# EasyEDA schematic 1-Schematic_ACS2STM-alt-IDC.json
TITLE: ACSI2STM Modified IDC; REV: 1; Date: 2023-06-16; Sheet: 1/1; Drawn By: jfcretro
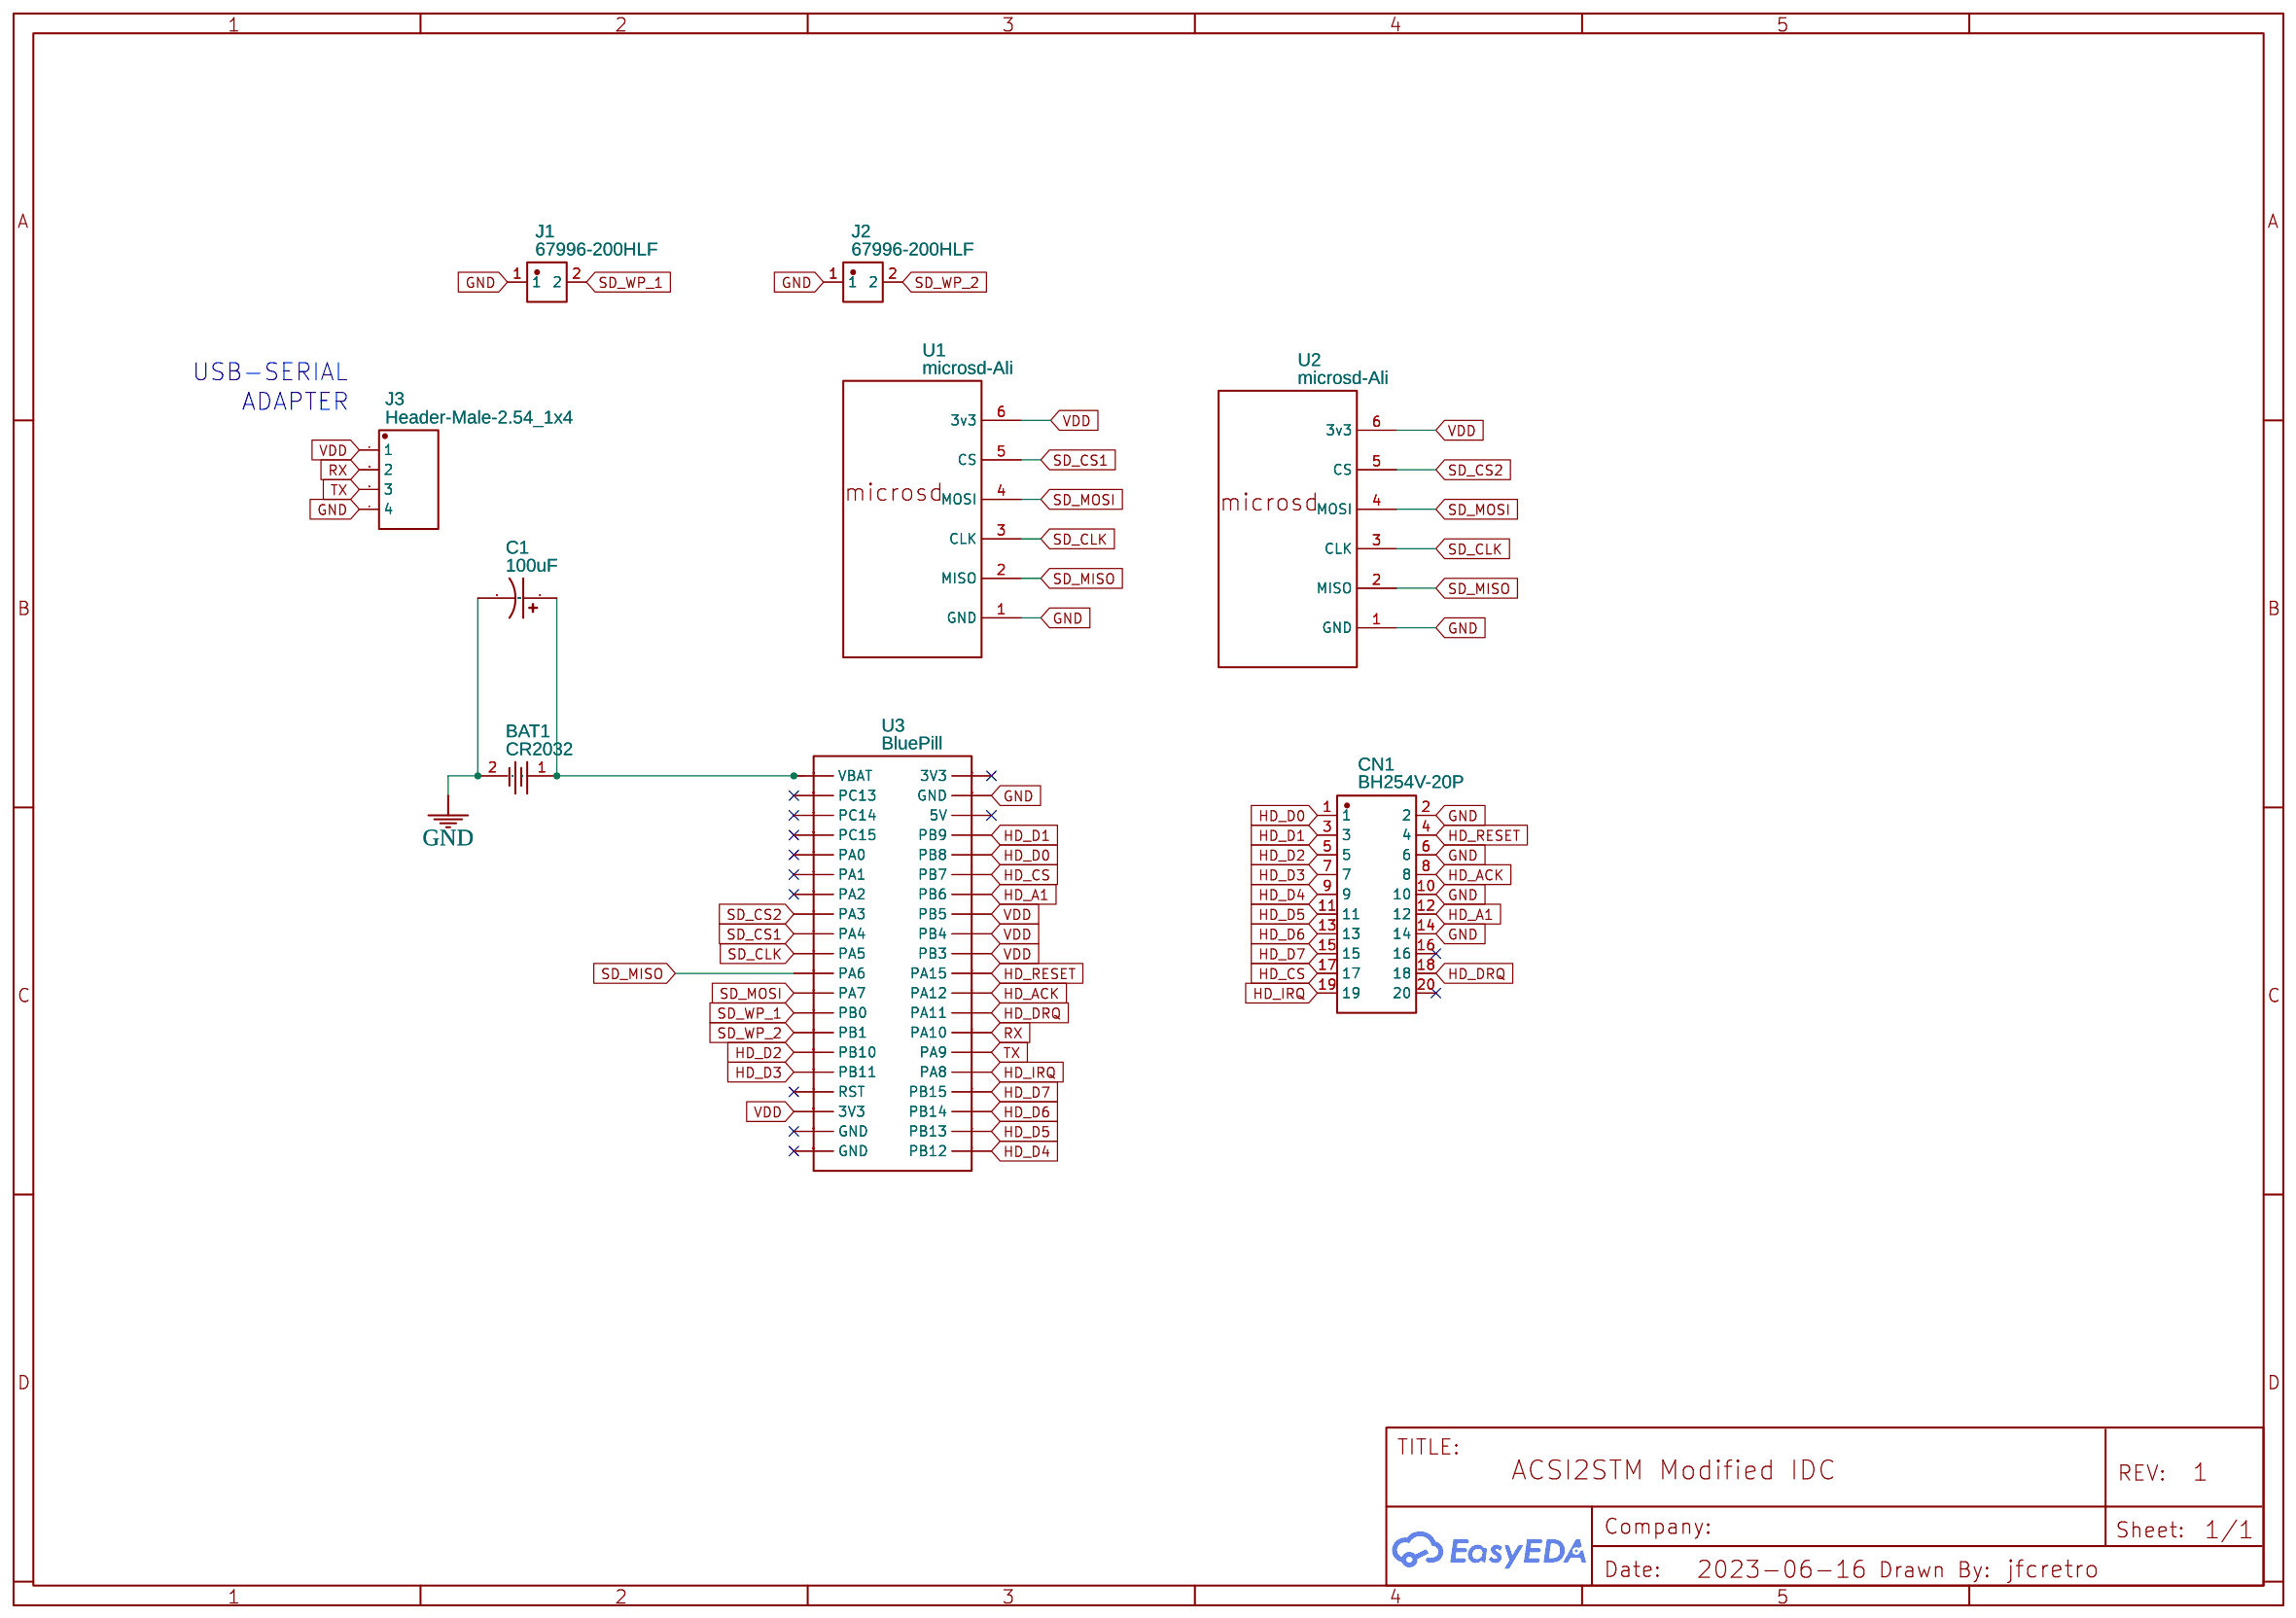
[diagram p0: schematic sheet]

## Parts
BAT1  CR2032  [BAT-TH_CR2032-1]
C1  100uF  [CAP-D6.3×F2.5]
CN1  BH254V-20P  [CONN-TH_20P-P2.54_0702462001]
J1  67996-200HLF  [HDR-TH_2P-P2.54-V-M-R2-C1-S2.54]
J2  67996-200HLF  [HDR-TH_2P-P2.54-V-M-R2-C1-S2.54]
J3  Header-Male-2.54_1x4  [HDR-TH_4P-P2.54-V-M]
U1  microsd-Ali  [MICROSDADAPTER]
U2  microsd-Ali  [MICROSDADAPTER]
U3  BluePill  [BLUEPILL]

## Library data of the parts
BAT1 = CR2032_C9900007674: Supplier: LCSC; Supplier Part: C9900007674; Manufacturer: null; link: https://atta.szlcsc.comnull; JLCPCB Part Class: Extended Part; Contributor: lcsc
C1 = CE_TH_D6.3×F2.5_US: Contributor: LCEDA_Lib
CN1 = BH254V-20P: Supplier: LCSC; Supplier Part: C492444; Manufacturer: XFCN(兴飞); Contributor: LCSC; JLCPCB Part Class: Extended Part
J1 J2 = 67996-200HLF: Supplier: LCSC; Supplier Part: C236045; Manufacturer: Amphenol; Contributor: LCSC
J3 = Header-Male-2.54_1x4: Supplier: LCSC; Manufacturer: Ckmtw(灿科盟); Manufacturer Part: B-2100S04P-A110; Contributor: LCSC; Supplier Part: C124378; JLCPCB Part Class: Extended Part
U1 = microsd-Ali: Contributor: jfceklosky
U2 = microsd-Ali: Contributor: jfceklosky; Package Display: No
U3 = BluePill: Contributor: alexander.gavrilenko

## Nets
GND: BAT1.2 C1.2 CN1.2 CN1.6 CN1.10 CN1.14 J1.1 J2.1 J3.4 U1.1(GND) U2.1(GND) U3.GND_3(GND)
VDD: J3.1 U1.6(3v3) U2.6(3v3) U3.3V3_1(3V3) U3.PB3 U3.PB4 U3.PB5
HD_A1: CN1.12 U3.PB6
HD_ACK: CN1.8 U3.PA12
HD_CS: CN1.17 U3.PB7
HD_D0: CN1.1 U3.PB8
HD_D1: CN1.3 U3.PB9
HD_D2: CN1.5 U3.PB10
HD_D3: CN1.7 U3.PB11
HD_D4: CN1.9 U3.PB12
HD_D5: CN1.11 U3.PB13
HD_D6: CN1.13 U3.PB14
HD_D7: CN1.15 U3.PB15
HD_DRQ: CN1.18 U3.PA11
HD_IRQ: CN1.19 U3.PA8
HD_RESET: CN1.4 U3.PA15
RX: J3.2 U3.PA10
SD_CLK: U1.3(CLK) U2.3(CLK) U3.PA5
SD_CS1: U1.5(CS) U3.PA4
SD_CS2: U2.5(CS) U3.PA3
SD_MISO: U1.2(MISO) U2.2(MISO) U3.PA6
SD_MOSI: U1.4(MOSI) U2.4(MOSI) U3.PA7
SD_WP_1: J1.2 U3.PB0
SD_WP_2: J2.2 U3.PB1
TX: J3.3 U3.PA9
Net-(BAT1-1): BAT1.1 C1.1 U3.VBAT

Not connected (* = marked no-connect by the designer): CN1 16* 20*; U3 3V3_2(3V3)* 5V* GND_1(GND)* GND_2(GND)* PA0* PA1* PA2* PC13* PC14* PC15* RST*

## Notes on the sheet
- USB-SERIAL
- ADAPTER
